# Altium schematic sheet optimum-project.SchDoc
size A4; SheetNumber: 2; SheetTotal: 3
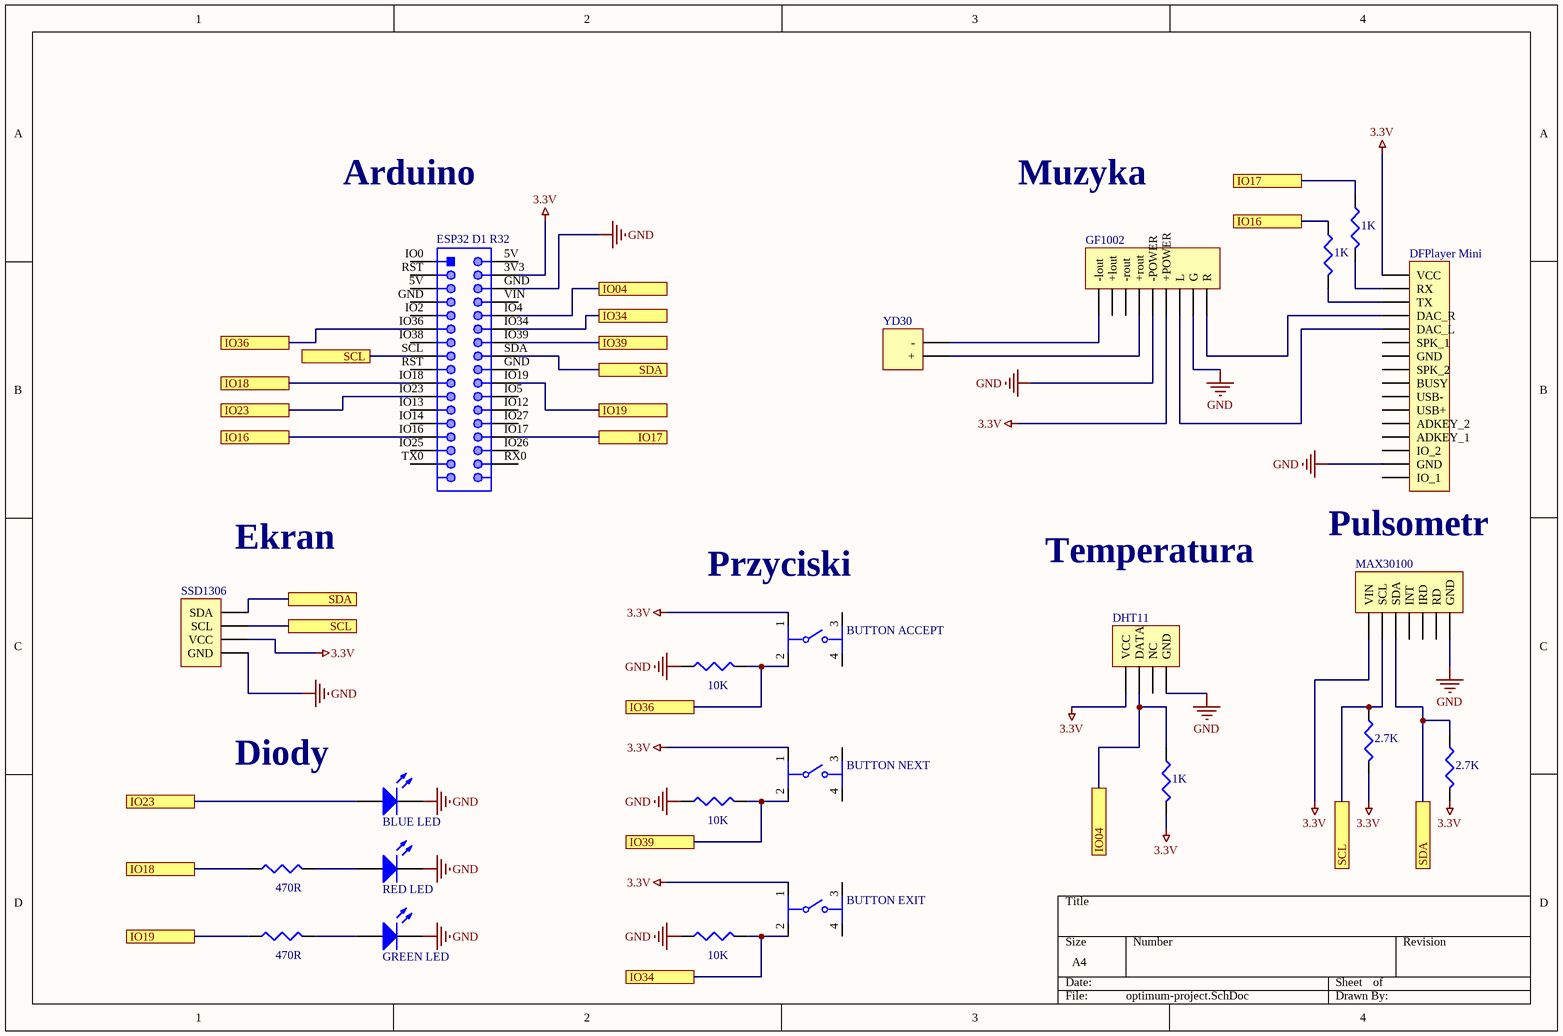
[diagram p0: optimum-project.SchDoc]

## Parts
(Parts that share a designator on the sheet are numbered #1, #2 ... from top to bottom, then left to right.)
?#1  BLUE LED  [3.2X1.6X1.1]
?#2  RED LED  [3.2X1.6X1.1]
?#3  GREEN LED  [3.2X1.6X1.1]
BUTTON_ACCEPT  3-1825910-1  [FP-3-1825910-1-MFG]  (value not drawn)
BUTTON_EXIT  3-1825910-1  [FP-3-1825910-1-MFG]  (value not drawn)
BUTTON_NEXT  3-1825910-1  [FP-3-1825910-1-MFG]  (value not drawn)
DFPlayer_Mini  Header 16  [HDR1X16]  (value not drawn)
DHT11  Header 4  [HDR1X4]  (value not drawn)
ESP32_D1_R32  61233420621  [61233420621]  (value not drawn)
GF1002  Header 9  [HDR1X9]  (value not drawn)
MAX30100  Header 7  [HDR1X7]  (value not drawn)
R?#1  value 1K  [J1-0603]  (hidden comment: Res3)
R?#2  value 1K  [J1-0603]  (hidden comment: Res3)
R?#3  value 10K  [J1-0603]  (hidden comment: Res3)
R?#4  value 2.7K  [J1-0603]  (hidden comment: Res3)
R?#5  value 2.7K  [J1-0603]  (hidden comment: Res3)
R?#6  value 1K  [J1-0603]  (hidden comment: Res3)
R?#7  value 10K  [J1-0603]  (hidden comment: Res3)
R?#8  value 470R  [J1-0603]  (hidden comment: Res3)
R?#9  value 470R  [J1-0603]  (hidden comment: Res3)
R?#10  value 10K  [J1-0603]  (hidden comment: Res3)
SSD1306  Ekran  [HDR1X4]  (value not drawn)
YD30  Header 2  [HDR1X2]  (value not drawn)

## Ports
IO04, IO16, IO17, IO18, IO19, IO23, IO34, IO36, IO39, SCL, SDA

## Nets
3.3V: BUTTON_ACCEPT.1 BUTTON_EXIT.1 BUTTON_NEXT.1 DFPlayer_Mini.1(VCC) DHT11.1(VCC) ESP32_D1_R32.3V3 GF1002.6(+POWER) MAX30100.1(VIN) R?#4.2 R?#5.2 R?#6.2 SSD1306.2(VCC)
GND: ?#1.2(K) ?#2.2(K) ?#3.2(K) DFPlayer_Mini.15(GND) DHT11.4(GND) ESP32_D1_R32.GND GF1002.5(-POWER) GF1002.8(G) MAX30100.7(GND) R?#3.1 R?#7.1 R?#10.1 SSD1306.1(GND)
IO04: DHT11.2(DATA) ESP32_D1_R32.IO4 R?#6.1 ; port IO04
IO16: ESP32_D1_R32.IO16 R?#2.1 ; port IO16
IO17: ESP32_D1_R32.IO17 R?#1.1 ; port IO17
IO18: ESP32_D1_R32.IO18 R?#8.1 ; port IO18
IO19: ESP32_D1_R32.IO19 R?#9.1 ; port IO19
IO23: ?#1.1(A) ESP32_D1_R32.IO23 ; port IO23
IO34: BUTTON_EXIT.2 ESP32_D1_R32.IO34 R?#10.2 ; port IO34
IO36: BUTTON_ACCEPT.2 ESP32_D1_R32.IO36 R?#3.2 ; port IO36
IO39: BUTTON_NEXT.2 ESP32_D1_R32.IO39 R?#7.2 ; port IO39
SCL: ESP32_D1_R32.SCL MAX30100.2(SCL) R?#4.1 SSD1306.3(SCL) ; port SCL
SDA: ESP32_D1_R32.SDA MAX30100.3(SDA) R?#5.1 SSD1306.4(SDA) ; port SDA
Net?#2_1: ?#2.1(A) R?#8.2
Net?#3_1: ?#3.1(A) R?#9.2
NetDFPlayer_Mini_2: DFPlayer_Mini.2(RX) R?#1.2
NetDFPlayer_Mini_3: DFPlayer_Mini.3(TX) R?#2.2
NetDFPlayer_Mini_4: DFPlayer_Mini.4(DAC_R) GF1002.9(R)
NetDFPlayer_Mini_5: DFPlayer_Mini.5(DAC_L) GF1002.7(L)
NetGF1002_1: GF1002.1(-lout) YD30.2(-)
NetGF1002_4: GF1002.4(+rout) YD30.1(+)

Not connected (* = marked no-connect by the designer): BUTTON_ACCEPT 3 4; BUTTON_EXIT 3 4; BUTTON_NEXT 3 4; DFPlayer_Mini 6(SPK_1) 7(GND) 8(SPK_2) 9(BUSY) 10(USB-) 11(USB+) 12(ADKEY_2) 13(ADKEY_1) 14(IO_2) 16(IO_1); DHT11 3(NC); ESP32_D1_R32 5V(2) IO0(1) IO2(9) IO5(22) IO12(24) IO13(23) IO14(25) IO25(29) IO26(30) IO27(26) IO38(13) RST(3) RX0(32) TX0(31) VIN(8); GF1002 2(+lout) 3(-rout); MAX30100 4(INT) 5(IRD) 6(RD)

## Notes on the sheet
- Arduino
- Muzyka
- Ekran
- Przyciski
- Temperatura
- (near DFPlayer_Mini) Pulsometr
- Diody

## Library data of the parts
?#1-?#3 = LED2: Typical RED, GREEN, YELLOW, AMBER GaAs LED; Published: 8-Jun-2000; LatestRevisionDate: 17-Jul-2002; LatestRevisionNote: Re-released for DXP Platform.; PackageVersion: Feb-2002; PackageReference: 3.2X1.6X1.1; Publisher: Altium Limited; PackageDescription: SM LED; 2 Flat Leads
BUTTON_ACCEPT BUTTON_EXIT BUTTON_NEXT = CMP-03407-000001-1: SWITCH TACTILE SPST-NO 0.05A 24V; Manufacturer: TE Connectivity; Operating Force: 160gf; Contact Current Rating: 50mA; Description: Switch Tactile OFF (ON) SPST Round Button PC Pins 0.05A 24VDC 100000Cycles 1.57N Thru-Hole; Contact Resistance: 100mΩ; Electromechanical Life: 100000Cycles; Device Class L1: Electromechanical; ComponentLink2URL: https://www.te.com/commerce/DocumentDelivery/DDEController?Action=srchrtrv&DocNm=1825910&DocType=Customer+Drawing&DocLang=English; Category: Switch; Device Class L2: Switches; Temperature: -35°C to +85°C; RoHS: TRUE; Mount: Through Hole; Manufacturer Part Number: 3-1825910-1; Automotive: No; Lead Free: Yes; Device Class L3: Tactile Switches; ComponentLink2Description: Datasheet; Temperature Range High: +85°C; Height: 17.3mm; Package: 0; Temperature Range Low: -35°C; Throw Configuration: SPST-NO; Digikey Description: SWITCH TACTILE SPST-NO 0.05A 24V; Octopart: https://octopart.com/3-1825910-1-te+connectivity-46506874
DFPlayer_Mini = Header 16: Header, 16-Pin; LatestRevisionDate: 17-Jul-2002; LatestRevisionNote: Re-released for DXP Platform.; Publisher: Altium Limited
DHT11 SSD1306 = Header 4: Header, 4-Pin; LatestRevisionDate: 17-Jul-2002; LatestRevisionNote: Re-released for DXP Platform.; Publisher: Altium Limited
ESP32_D1_R32 = CMP-1502-00065-1: Male Box Header WR-BHD, SMT, Vertical, pitch 2.54 mm, 34 pins; Manufacturer: Wurth Elektronik; Pitch: 2.54mm; Pin Number: 34; Contact Resistance: 20mOhm; Withstanding Voltage: 500VAC; Working Voltage: 250VAC; Operating Temperature: -40to125degC; Mounting Technology: SMT; Package Reference: 61233420621; Datasheet URL: https://katalog.we-online.de/em/datasheet/6123xx20621.pdf; Manufacturer URL: http://www.we-online.de; Gender: Male; Published Date: August2018; Packaging: TapeandReel; Publisher: WurthElektronik; Orientation: Vertical; Part Number: 61233420621
GF1002 = Header 9: Header, 9-Pin; LatestRevisionDate: 17-Jul-2002; LatestRevisionNote: Re-released for DXP Platform.; Publisher: Altium Limited
MAX30100 = Header 7: Header, 7-Pin; LatestRevisionDate: 17-Jul-2002; LatestRevisionNote: Re-released for DXP Platform.; Publisher: Altium Limited
R?#1-R?#10 = Res3: Resistor; Published: 8-Jun-2000; LatestRevisionDate: 29-May-2009; LatestRevisionNote: IPC-7351 Footprint Added.; PackageReference: J1-0603; Publisher: Altium Limited; PackageDescription: Chip Resistor
YD30 = Header 2: Header, 2-Pin; LatestRevisionDate: 17-Jul-2002; LatestRevisionNote: Re-released for DXP Platform.; Publisher: Altium Limited